# Altium project DuAn_HighVoltage_V3.PrjPcb (part 2 of 2)

## Sheet CHARGER.SchDoc
size 420 x 297 mm; SheetNumber: 18; SheetTotal: 20
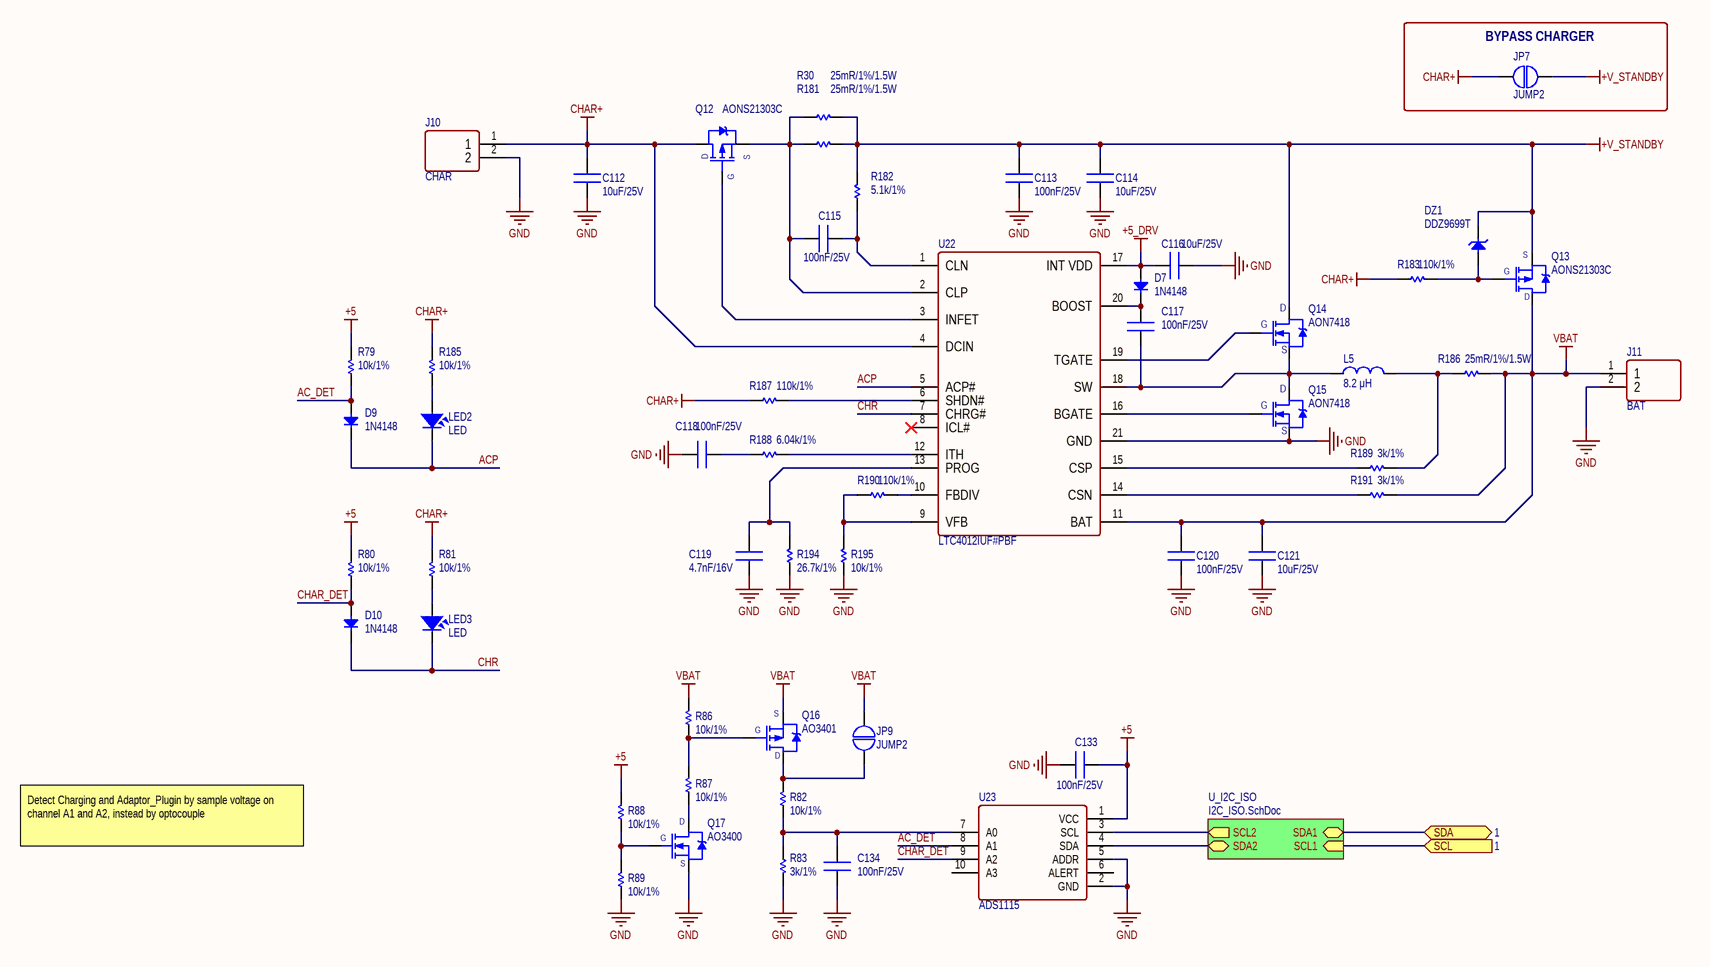
[diagram p17: CHARGER.SchDoc]

### Parts
C112  10uF/25V  [CN-SMD-0603]
C113  100nF/25V  [CN-SMD-0603]
C114  10uF/25V  [CN-SMD-0603]
C115  100nF/25V  [CN-SMD-0603]
C116  10uF/25V  [CN-SMD-0603]
C117  100nF/25V  [CN-SMD-0603]
C118  100nF/25V  [CN-SMD-0603]
C119  4.7nF/16V  [CN-SMD-0603]
C120  100nF/25V  [CN-SMD-0603]
C121  10uF/25V  [CN-SMD-0603]
C133  100nF/25V  [CN-SMD-0603]
C134  100nF/25V  [CN-SMD-0603]
D7  1N4148  [DIO-SMD-323]
D9  1N4148  [DIO-SMD-323]
D10  1N4148  [DIO-SMD-323]
DZ1  DDZ9699T  [DIO-SMD-523]
J10  CHAR  [S2P-VH(LF)(SN)]
J11  BAT  [S2P-VH(LF)(SN)]
JP7  JUMP2  [JUMPER_2012]  (no BOM)
JP9  JUMP2  [JUMPER_2012]  (no BOM)
L5  8.2 μH  [PSM1040]
LED2  LED  [LED-0603-RED]
LED3  LED  [LED-0603-RED]
Q12  AONS21303C  [PowerPAK SO-8 Single]
Q13  AONS21303C  [PowerPAK SO-8 Single]
Q14  AON7418  [DFN3.3x3.3_8L]
Q15  AON7418  [DFN3.3x3.3_8L]
Q16  AO3401  [SOT23-123]
Q17  AO3400  [SOT23-123]
R30  25mR/1%/1.5W  [RES-SMD-1206]
R79  10k/1%  [RES-SMD-0603]
R80  10k/1%  [RES-SMD-0603]
R81  10k/1%  [RES-SMD-0603]
R82  10k/1%  [RES-SMD-0603]
R83  3k/1%  [RES-SMD-0603]
R86  10k/1%  [RES-SMD-0603]
R87  10k/1%  [RES-SMD-0603]
R88  10k/1%  [RES-SMD-0603]
R89  10k/1%  [RES-SMD-0603]
R181  25mR/1%/1.5W  [RES-SMD-1206]
R182  5.1k/1%  [RES-SMD-0603]
R183  110k/1%  [RES-SMD-0603]
R185  10k/1%  [RES-SMD-0603]
R186  25mR/1%/1.5W  [RES-SMD-1206]
R187  110k/1%  [RES-SMD-0603]
R188  6.04k/1%  [RES-SMD-0603]
R189  3k/1%  [RES-SMD-0603]
R190  110k/1%  [RES-SMD-0603]
R191  3k/1%  [RES-SMD-0603]
R194  26.7k/1%  [RES-SMD-0603]
R195  10k/1%  [RES-SMD-0603]
U22  LTC4012IUF#PBF  [PQFN50P400X400X80_HS-21N]
U23  ADS1115  [R-PQFP-N10]

### Blocks framed on the sheet
BYPASS CHARGER: JP7

### Sub-sheets
U_I2C_ISO = I2C_ISO.SchDoc: SDA1 (bidir), SCL1 (in), SDA2 (bidir), SCL2 (out)

### Ports
SCL (in, see 1), SDA (bidir, see 1)

### Nets
+5: C133.2 R79.2 R80.2 R88.2 U23.1(VCC)
+5_DRV: C116.1 D7.1(A) U22.17(INT_VDD)
+V_STANDBY: C113.1 C114.1 DZ1.2(K) JP7.2 Q13.1,2,3(S) Q14.5,6,7,8,9(D) R30.2 R181.2 R182.2
CHAR+: C112.1 J10.1 JP7.1 Q12.5(D) R81.2 R183.1 R185.2 R187.1 U22.4(DCIN)
GND: C112.2 C113.2 C114.2 C116.2 C118.2 C119.2 C120.2 C121.2 C133.1 C134.2 J10.2 J11.2 Q15.1,2,3(S) Q17.3(S) R83.2 R89.1 R194.1 R195.1 U22.21(GND) U23.2(GND) U23.5(ADDR)
VBAT: C120.1 C121.1 J11.1 JP9.2 Q13.5(D) Q16.3(S) R86.2 R186.2 R191.2 U22.11(BAT)
AC_DET: D9.1(A) R79.1 U23.8(A1)
ACP: D9.2(K) LED2.2 U22.5(ACP#)
CHAR_DET: D10.1(A) R80.1 U23.9(A2)
CHAR_SCL: port SCL, sheet U_I2C_ISO/SCL1
CHAR_SDA: port SDA, sheet U_I2C_ISO/SDA1
CHR: D10.2(K) LED3.2 U22.7(CHRG#)
NetC115_1: C115.1 R182.1 U22.1(CLN)
NetC115_2: C115.2 Q12.1,2,3(S) R30.1 R181.1 U22.2(CLP)
NetC117_1: C117.1 L5.1 Q14.1,2,3(S) Q15.5,6,7,8,9(D) U22.18(SW)
NetC117_2: C117.2 D7.2(K) U22.20(BOOST)
NetC118_1: C118.1 R188.1
NetC119_1: C119.1 R194.2 U22.13(PROG)
NetC134_1: C134.1 R82.1 R83.1 U23.7(A0)
NetDZ1_1: DZ1.1(A) Q13.4(G) R183.2
NetJP9_1: JP9.1 Q16.2(D) R82.2
NetL5_2: L5.2 R186.1 R189.2
NetLED2_1: LED2.1 R185.1
NetLED3_1: LED3.1 R81.1
NetQ12_4: Q12.4(G) U22.3(INFET)
NetQ14_4: Q14.4(G) U22.19(TGATE)
NetQ15_4: Q15.4(G) U22.16(BGATE)
NetQ16_1: Q16.1(G) R86.1 R87.2
NetQ17_1: Q17.1(G) R88.1 R89.2
NetQ17_2: Q17.2(D) R87.1
NetR175_2: U23.4(SDA) ; sheet U_I2C_ISO/SDA2
NetR176_2: U23.3(SCL) ; sheet U_I2C_ISO/SCL2
NetR187_2: R187.2 U22.6(SHDN#)
NetR188_2: R188.2 U22.12(ITH)
NetR189_1: R189.1 U22.15(CSP)
NetR190_1: R190.1 R195.2 U22.9(VFB)
NetR190_2: R190.2 U22.10(FBDIV)
NetR191_1: R191.1 U22.14(CSN)

Not connected (* = marked no-connect by the designer): U22 8(ICL#)*; U23 6(ALERT) 10(A3)

### Notes on the sheet
- Detect Charging and Adaptor_Plugin by sample voltage on channel A1 and A2, instead by optocouple
- Project:
- Sub-system:
- Design by:
- Sheet title:
- Sheet
- of
- Checked by:
- Approved by:
- Document No:
- Revision:
- Size:
- Date:

### Library data of the parts
C112 C114 C116 C121 = CN: CAP CER 10UF 25V X5R 0603; PN: CL10A106MA8NRNC
C113 C115 C117 C118 C120 C133 C134 = CN: CAP CER 0.1UF 25V X7R 0603; PN: CL10B104KA8NNNC
C119 = CN: 4700 pF ±10% 16V Ceramic Capacitor X7R 0603 (1608 Metric); PN: C0603C472K4RECAUTO
D7 D9 D10 = Diode SMD: DIODE STANDARD 100V 150MA SOD323; Code - JEDEC: DO-214-AB; PN: 1N4148WX-TP; Published: 8-Jun-2000; Revision: July-2002: Re-released for DXP Platform.; Publisher: Altium Limited
DZ1 = DIODE Zener: DIODE ZENER 12V 150MW SOD523; PN: DDZ9699T-7
J10 J11 = KF2: CONN HEADER R/A 2POS 3.96MM; PN: S2P-VH; ComponentLink1 Description: Manufacturer; ComponentLink2 Description: Datasheet; ComponentLink1URL: http://www.we-online.com; ComponentLink2URL: http://katalog.we-online.de/em/datasheet/6911031100xx.pdf
L5 = L-SMD-1: FIXED IND 8.2UH 8A 24 MOHM SMD; Manufacturer: Wurth Elektronik; PN: SRP1038A-8R2M; Inductance: 8.2 μH; ComponentLink1Description: Manufacturer; ComponentLink1URL: http://www.we-online.de; Created by: Baojun Chen; Created Date: Nov.2015; ComponentLink2Description: Datasheet; ComponentLink2URL: http://katalog.we-online.de/pbs/datasheet/78477010.pdf
LED2 LED3 = LED SMD: LED RED CLEAR 0603 SMD; PN: 150060RS75000
Q12 Q13 = AONS21303C: MOSFET P-CH 30V 180A 8DFN; PN: AONS21303C
Q14 Q15 = AON7292: MOSFET N-CH 30V 46A/50A 8DFN; PN: AON7418
Q16 = AO3401: P-MOS 30V 4A
Q17 = AO3400: MOSFET N-CH 30V 5.7A SOT23-3L; PN: AO3400
R30 R181 R186 = Res-SMD: RESISTOR - ISA-PLAN SHUNT, 0.025; Manufacturer: Generic Components; PN: VMK-R025-1.0-U; Class: Passive; Publisher: Altium Hobart Technology Centre
R79-R82 R86-R89 R185 R195 = Res-SMD: RES SMD 10K OHM 1% 1/10W 0603; Manufacturer: Generic Components; PN: ERJ-3EKF1002V; Class: Passive; Publisher: Altium Hobart Technology Centre
R83 R189 R191 = Res-SMD: RES SMD 3K OHM 0.1% 1/10W 0603; Manufacturer: Generic Components; PN: ERA-3AEB302V; Class: Passive; Publisher: Altium Hobart Technology Centre
R182 = Res-SMD: RES SMD 5.1K OHM 1% 1/10W 0603; Manufacturer: Generic Components; PN: ERJ-3EKF5101V; Class: Passive; Publisher: Altium Hobart Technology Centre
R183 R187 R190 = Res-SMD: RES 110K OHM 1% 1/10W 0603; Manufacturer: Generic Components; PN: RC0603FR-07110KL; Class: Passive; Publisher: Altium Hobart Technology Centre
R188 = Res-SMD: RES 6.04K OHM 1% 1/10W 0603; Manufacturer: Generic Components; PN: RC0603FR-076K04L; Class: Passive; Publisher: Altium Hobart Technology Centre
R194 = Res-SMD: RES 26.7K OHM 1% 1/10W 0603; Manufacturer: Generic Components; PN: RMCF0603FT26K7; Class: Passive; Publisher: Altium Hobart Technology Centre
U22 = LTC4012: IC BAT CHG MULT-CHEM 1-4CL 20QFN; PN: LTC4012IUF#PBF
U23 = ADS1115: IC ADC 16BIT SIGMA-DELTA 10X2QFN; pin to pad: 1>8 2>3 3>10 4>9 5>1 6>2 7>4 8>5 9>6 10>7; PN: ADS1115IRUGR

## Sheet I2C_ISO.SchDoc
size 420 x 297 mm; SheetNumber: 18; SheetTotal: 19
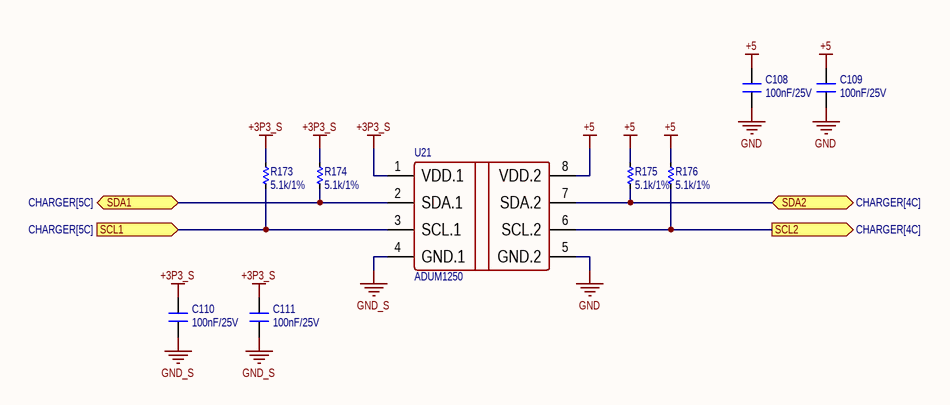
[diagram p18: I2C_ISO.SchDoc]

### Parts
C108  100nF/25V  [CN-SMD-0603]
C109  100nF/25V  [CN-SMD-0603]
C110  100nF/25V  [CN-SMD-0603]
C111  100nF/25V  [CN-SMD-0603]
R173  5.1k/1%  [RES-SMD-0603]
R174  5.1k/1%  [RES-SMD-0603]
R175  5.1k/1%  [RES-SMD-0603]
R176  5.1k/1%  [RES-SMD-0603]
U21  ADUM1250  [SO8]

### Ports
SCL1 (in, see CHARGER[5C]), SCL2 (out, see CHARGER[4C]), SDA1 (bidir, see CHARGER[5C]), SDA2 (bidir, see CHARGER[4C])

### Nets
+3P3_S: C110.1 C111.1 R173.1 R174.1 U21.1(VDD.1)
+5: C108.1 C109.1 R175.1 R176.1 U21.8(VDD.2)
GND: C108.2 C109.2 U21.5(GND.2)
GND_S: C110.2 C111.2 U21.4(GND.1)
CHAR_SCL: R173.2 U21.3(SCL.1) ; port SCL1
CHAR_SDA: R174.2 U21.2(SDA.1) ; port SDA1
NetR175_2: R175.2 U21.7(SDA.2) ; port SDA2
NetR176_2: R176.2 U21.6(SCL.2) ; port SCL2

### Notes on the sheet
- Project:
- Sub-system:
- Design by:
- Sheet title:
- Sheet
- of
- Checked by:
- Approved by:
- Document No:
- Revision:
- Size:
- Date:

### Library data of the parts
C108-C111 = CN: as C113 on sheet CHARGER
R173-R176 = Res-SMD: as R182 on sheet CHARGER; Publisher: Altium Hobart Technology Centre
U21 = ADUM1250: DGTL ISOLTR 2.5KV 2CH I2C 8-SOIC; PN: ADUM1250ARZ-RL7

## Sheet EEPROM.SchDoc
size 420 x 297 mm; SheetNumber: 11; SheetTotal: 20
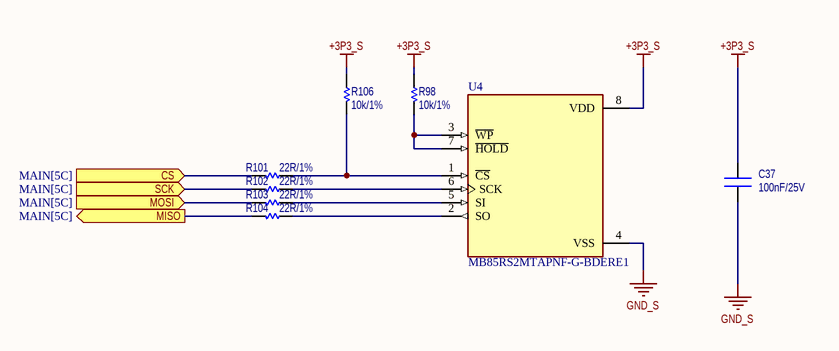
[diagram p19: EEPROM.SchDoc]

### Parts
(Parts that share a designator on the sheet are numbered #1, #2 ... from top to bottom, then left to right.)
C37#2  100nF/25V  [CN-SMD-0603]
R98  10k/1%  [RES-SMD-0603]
R101  22R/1%  [RES-SMD-0603]
R102  22R/1%  [RES-SMD-0603]
R103  22R/1%  [RES-SMD-0603]
R104  22R/1%  [RES-SMD-0603]
R106  10k/1%  [RES-SMD-0603]
U4#2  MB85RS2MTAPNF-G-BDERE1  [SOIC127P602X173-8N]

### Ports
CS (in, see MAIN[5C]), MISO (out, see MAIN[5C]), MOSI (in, see MAIN[5C]), SCK (in, see MAIN[5C])

### Nets
+3P3_S: C37#2.1 R98.1 R106.1 U4#2.8(VDD)
GND_S: C37#2.2 U4#2.4(VSS)
EEPROM_CS: R101.2 ; port CS
EEPROM_MISO: R104.2 ; port MISO
EEPROM_MOSI: R103.2 ; port MOSI
EEPROM_SCK: R102.2 ; port SCK
NetR98_2: R98.2 U4#2.3(~{WP}) U4#2.7(~{HOLD})
NetR101_1: R101.1 R106.2 U4#2.1(~{CS})
NetR102_1: R102.1 U4#2.6(SCK)
NetR103_1: R103.1 U4#2.5(SI)
NetR104_1: R104.1 U4#2.2(SO)

### Notes on the sheet
- Project:
- Sub-system:
- Design by:
- Sheet title:
- Sheet
- of
- Checked by:
- Approved by:
- Document No:
- Revision:
- Size:
- Date:

### Library data of the parts
C37#2 = CN: as C113 on sheet CHARGER
R98 R106 = Res-SMD: as R79 on sheet CHARGER; Publisher: Altium Hobart Technology Centre
R101-R104 = Res-SMD: RES SMD 22 OHM 1% 1/10W 0603; PN: ERJ-3EKF22R0V
U4#2 = MB85RS2MTAPNF-G-BDERE1: IC FRAM 2MBIT SPI 40MHZ 8SOP; MF: Fujitsu Electronics; SnapEDA_Link: https://www.snapeda.com/parts/MB85RS2MTAPNF-G-BDERE1/Fujitsu/view-part/?ref=snap; Package: SO-8 Fujitsu; Value: *; MP: MB85RS2MTAPNF-G-BDERE1; Check_prices: https://www.snapeda.com/parts/MB85RS2MTAPNF-G-BDERE1/Fujitsu/view-part/?ref=eda; PN: MB85RS2MTAPNF-G-BDERE1

## Nets that join several sheets
+3P3_S: MAIN (13 pins), RS232 (C68.2 C141.2 U9.1 U25.1), FLYBACK_300V (5 pins), FLYBACK_300V/TEMPERATURE_SENSOR (C74A.2 U11A.1), FLYBACK_50V (5 pins), FLYBACK_50V/TEMPERATURE_SENSOR (C74B.2 U11B.1), SECONDARY_POWER (C64.2 C65.2 U7.2,4), ACCELEROMETER (22 pins), ANALOG (C81.1 C84.1 U14.5 U15.5), OVP (6 pins), XBEE (C105.2 C106.2 R170.1 U20.1), POWER_CON (JP5.5), COMUNICATE_CON (J8.1), PERIPHERAL_CON (R196.1 R197.1 R198.1 R199.1), I2C_ISO (5 pins), EEPROM (C37#2.1 R98.1 R106.1 U4#2.8)
+5: RS232 (8 pins), EXTERNAL_FAN1 (R26A.1), EXTERNAL_FAN2 (R26B.1), PRIMARY_POWER (5 pins), COMUNICATE_CON (JP8.4), CHARGER (5 pins), I2C_ISO (5 pins)
+5_S: SECONDARY_POWER (8 pins), POWER_CON (JP5.6), COMUNICATE_CON (JP8.6)
+12_S: FLYBACK_300V (C3A.2 C4A.2 U1A.11), FLYBACK_50V (C3B.2 C4B.2 U1B.11), SECONDARY_POWER (9 pins), POWER_CON (JP5.4)
+50_S: FLYBACK_50V (D1B.2), CAPACITOR (C23.1 C24.1 R14.1 R15.1), ANALOG (R55.1), CAP_RELEASE (R77.1 R78.1), POWER_CON (6 pins)
+300_S: FLYBACK_300V (D1A.2), CAPACITOR (12 pins), ANALOG (R50.1), CAP_RELEASE (R71.1), POWER_CON (6 pins)
+V_STANDBY: INPUT_PROTECTION (6 pins), CHARGER (9 pins)
+V_SYS: EXTERNAL_FAN1 (C66A.1 D5A.2 J3A.1), EXTERNAL_FAN2 (C66B.1 D5B.2 J3B.1), FLYBACK_300V (11 pins), FLYBACK_50V (11 pins), INPUT_PROTECTION (6 pins), SECONDARY_POWER (5 pins), PRIMARY_POWER (17 pins)
GND: RS232 (10 pins), EXTERNAL_FAN1 (Q5A.3 R28A.1), EXTERNAL_FAN2 (Q5B.3 R28B.1), FLYBACK_300V (7 pins), FLYBACK_50V (7 pins), INPUT_PROTECTION (7 pins), SECONDARY_POWER (5 pins), PRIMARY_POWER (22 pins), COMUNICATE_CON (JP8.3), CHARGER (21 pins), I2C_ISO (C108.2 C109.2 U21.5)
GND_S: MAIN (16 pins), RS232 (C68.1 C141.1 U9.4 U25.4), EXTERNAL_FAN1 (U8A.K), EXTERNAL_FAN2 (U8B.K), FLYBACK_300V (13 pins), FLYBACK_300V/TEMPERATURE_SENSOR (C74A.1 C75A.1 U11A.3), FLYBACK_50V (13 pins), FLYBACK_50V/TEMPERATURE_SENSOR (C74B.1 C75B.1 U11B.3), CAPACITOR (16 pins), SECONDARY_POWER (19 pins), ACCELEROMETER (16 pins), ANALOG (10 pins), OVP (10 pins), XBEE (5 pins), POWER_CON (15 pins), COMUNICATE_CON (J8.2 J9.3 JP6.8 JP8.1), PERIPHERAL_CON (J12.2 J12.4 J14.2 J14.4), I2C_ISO (C110.2 C111.2 U21.4), EEPROM (C37#2.2 U4#2.4)
50V_FB_MCU: MAIN (U13.8), ANALOG (C86.1 R57.1)
300V_FB_MCU: MAIN (U13.10), ANALOG (C83.1 R53.1)
CALL_HV: MAIN (U13.4), COMUNICATE_CON (JP6.3)
CHAR_SCL: MAIN (U13.29), I2C_ISO (R173.2 U21.3)
CHAR_SDA: MAIN (U13.30), I2C_ISO (R174.2 U21.2)
DEBUG_RX: MAIN (U13.38), COMUNICATE_CON (R178.2)
DEBUG_TX: MAIN (U13.37), COMUNICATE_CON (R177.2)
EEPROM_CS: MAIN (U13.45), EEPROM (R101.2)
EEPROM_MISO: MAIN (U13.52), EEPROM (R104.2)
EEPROM_MOSI: MAIN (U13.53), EEPROM (R103.2)
EEPROM_SCK: MAIN (U13.51), EEPROM (R102.2)
FAN_PWM1: MAIN (U13.16), EXTERNAL_FAN1 (R27A.1)
FAN_PWM2: MAIN (U13.17), EXTERNAL_FAN2 (R27B.1)
LED1: MAIN (U13.15), PERIPHERAL_CON (R84.1)
LED2: MAIN (U13.14), PERIPHERAL_CON (R85.1)
MCU_CAP_DISCHARGE_1: MAIN (U13.43), FLYBACK_300V (R3A.2)
MCU_CAP_DISCHARGE_2: MAIN (U13.56), FLYBACK_50V (R3B.2)
MCU_FLYBACK_SD_1: MAIN (U13.42), FLYBACK_300V (R5A.2)
MCU_FLYBACK_SD_2: MAIN (U13.54), FLYBACK_50V (R5B.2)
MCU_FLYBACK_SW_1: MAIN (U13.44), FLYBACK_300V (R1A.2)
MCU_FLYBACK_SW_2: MAIN (U13.57), FLYBACK_50V (R1B.2)
MCU_FLYBACK_TEMP_1: MAIN (U13.24), FLYBACK_300V/TEMPERATURE_SENSOR (C75A.2 R35A.1)
MCU_FLYBACK_TEMP_2: MAIN (U13.25), FLYBACK_50V/TEMPERATURE_SENSOR (C75B.2 R35B.1)
NetQ2A_2: FLYBACK_300V (Q2A.2), CAP_RELEASE (R76.2)
NetQ2B_2: FLYBACK_50V (Q2B.2), CAP_RELEASE (R77.2 R78.2)
NetR53_2: ANALOG (R53.2 U14.1 U14.4), OVP (R60.2)
NetR57_2: ANALOG (R57.2 U15.1 U15.4), OVP (R65.2)
NetR175_2: CHARGER (U23.4), I2C_ISO (R175.2 U21.7)
NetR176_2: CHARGER (U23.3), I2C_ISO (R176.2 U21.6)
ONBOARD_SEN_INT_1: MAIN (U13.28), ACCELEROMETER (R44.2)
ONBOARD_SEN_INT_2: MAIN (U13.26), ACCELEROMETER (R45.2)
ONBOARD_SEN_INT_3: MAIN (U13.27), ACCELEROMETER (R99.2)
ONBOARD_SEN_INT_4: MAIN (U13.55), ACCELEROMETER (R100.2)
ONBOARD_SEN_SCL: MAIN (U13.61), ACCELEROMETER (R42.2)
ONBOARD_SEN_SDA: MAIN (U13.62), ACCELEROMETER (R43.2)
OVP_MCU_50: MAIN (U13.9), FLYBACK_50V (R97B.2), OVP (R66.1 U17.1)
OVP_MCU_300: MAIN (U13.11), FLYBACK_300V (R97A.2), OVP (R61.1 U16.1)
PERIPH_PUSH_BUTTON: MAIN (U13.50), PERIPHERAL_CON (R200.1)
PERIPH_PUSH_LED: MAIN (U13.35), PERIPHERAL_CON (R203.1)
RS232_RX1: RS232 (R32.2), COMUNICATE_CON (JP6.9)
RS232_RX2: RS232 (R91.2), COMUNICATE_CON (JP6.7)
RS232_TX1: RS232 (R29.2), COMUNICATE_CON (JP6.2)
RS232_TX2: RS232 (R90.2), COMUNICATE_CON (JP6.4)
SENSOR_INT_1: MAIN (U13.23), PERIPHERAL_CON (R201.1)
SENSOR_INT_2: MAIN (U13.22), PERIPHERAL_CON (R202.1)
SENSOR_INT_3: MAIN (U13.21), PERIPHERAL_CON (R204.1)
SENSOR_INT_4: MAIN (U13.20), PERIPHERAL_CON (R205.1)
SENSOR_SCL: MAIN (U13.41), ACCELEROMETER (R49.2)
SENSOR_SDA: MAIN (U13.40), ACCELEROMETER (R48.2)
SLAVE_RX: MAIN (U13.59), COMUNICATE_CON (JP6.6)
SLAVE_TX: MAIN (U13.58), COMUNICATE_CON (JP6.5)
SWCLK: MAIN (U13.49), COMUNICATE_CON (R180.2)
SWDIO: MAIN (U13.46), COMUNICATE_CON (R179.2)
XBEE_RX: XBEE (R171.2), COMUNICATE_CON (JP6.10)
XBEE_TX: XBEE (R169.2), COMUNICATE_CON (JP6.1)

## Assembly variants
Variant of DuAn_HighVoltage_V3: all parts fitted